# Altium schematic sheet rx.SchDoc
size Letter; CompanyName: Signal Laboratories, Inc.; Address1: 3479 Edison Way; Address2: Menlo Park CA 94025; Address3: +1 (877) 778-8435; Address4: siglabs.com; Revision: 1; SheetNumber: 1; SheetTotal: 1
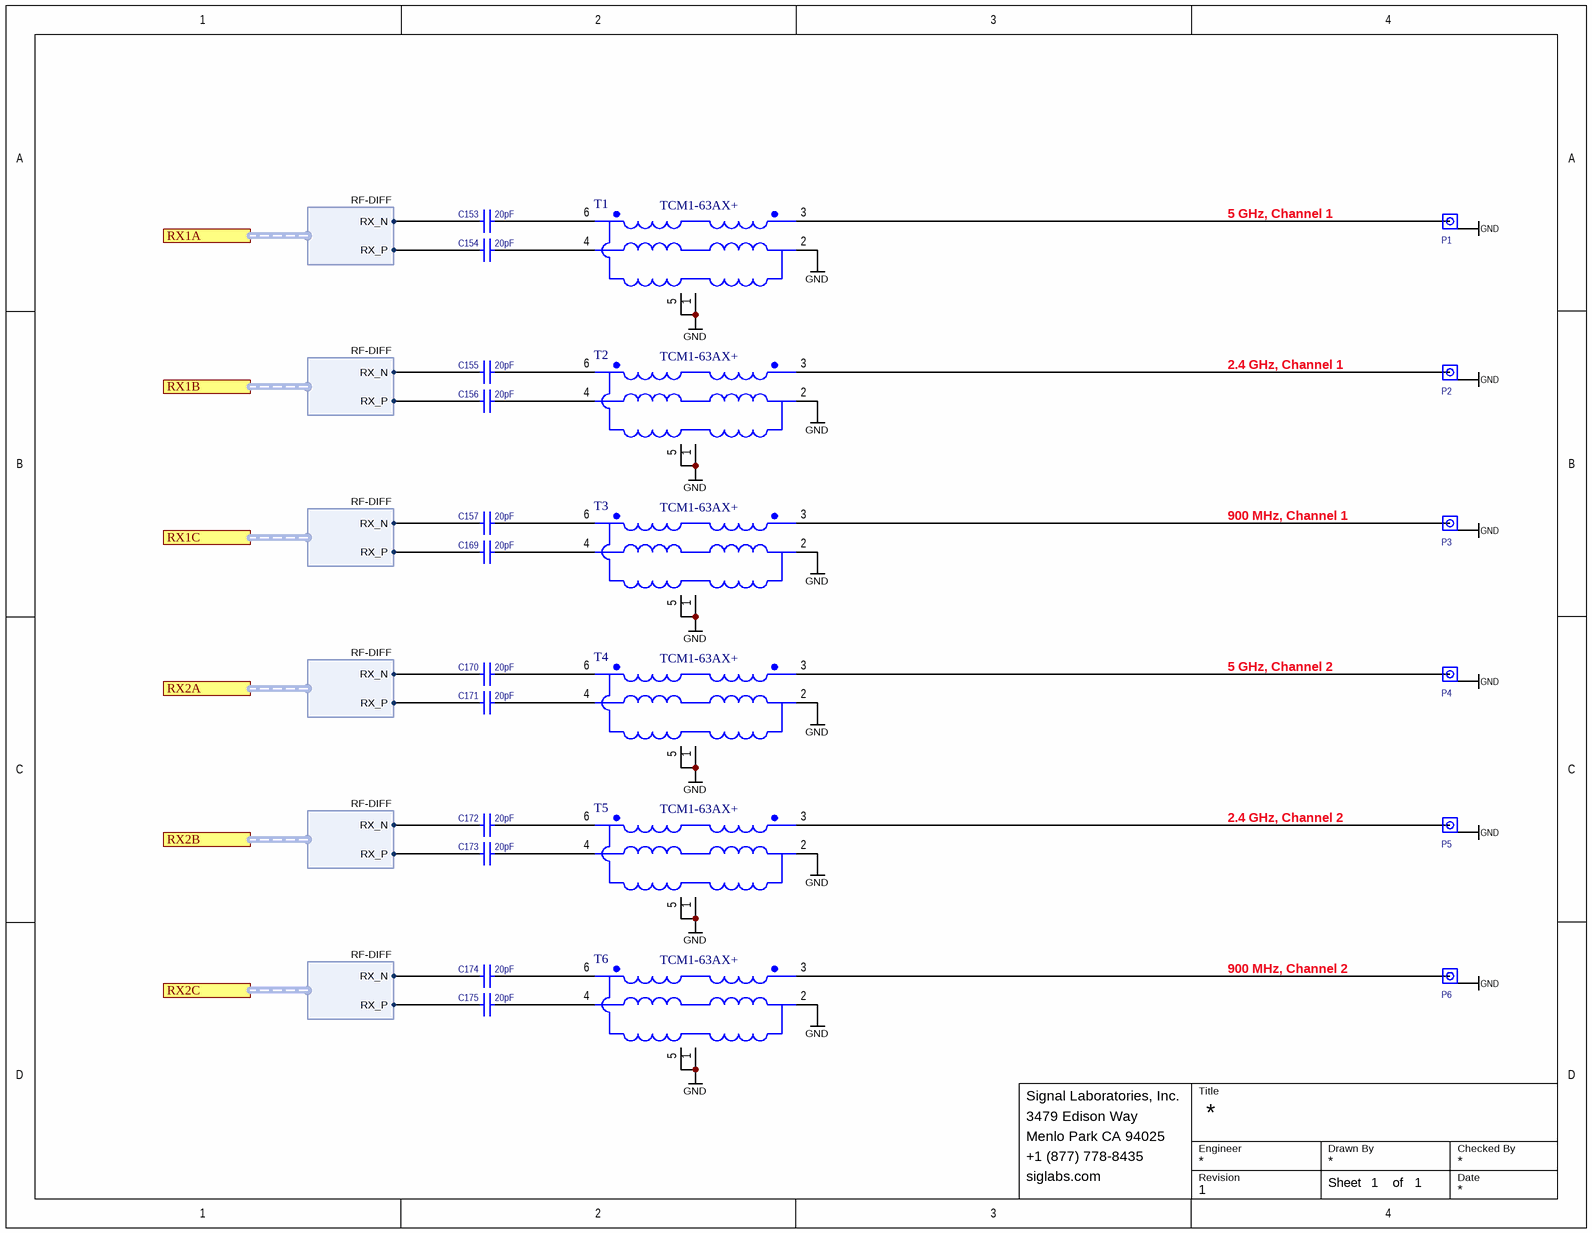
[diagram p0: rx.SchDoc]

## Parts
C153  value 20pF  [0402]  (hidden comment: CBR04C200F5GAC)
C154  value 20pF  [0402]  (hidden comment: CBR04C200F5GAC)
C155  value 20pF  [0402]  (hidden comment: CBR04C200F5GAC)
C156  value 20pF  [0402]  (hidden comment: CBR04C200F5GAC)
C157  value 20pF  [0402]  (hidden comment: CBR04C200F5GAC)
C169  value 20pF  [0402]  (hidden comment: CBR04C200F5GAC)
C170  value 20pF  [0402]  (hidden comment: CBR04C200F5GAC)
C171  value 20pF  [0402]  (hidden comment: CBR04C200F5GAC)
C172  value 20pF  [0402]  (hidden comment: CBR04C200F5GAC)
C173  value 20pF  [0402]  (hidden comment: CBR04C200F5GAC)
C174  value 20pF  [0402]  (hidden comment: CBR04C200F5GAC)
C175  value 20pF  [0402]  (hidden comment: CBR04C200F5GAC)
P1  U.FL-R-SMT(10)  [U.FL-R-SMT(10)]  (value not drawn)
P2  U.FL-R-SMT(10)  [U.FL-R-SMT(10)]  (value not drawn)
P3  U.FL-R-SMT(10)  [U.FL-R-SMT(10)]  (value not drawn)
P4  U.FL-R-SMT(10)  [U.FL-R-SMT(10)]  (value not drawn)
P5  U.FL-R-SMT(10)  [U.FL-R-SMT(10)]  (value not drawn)
P6  U.FL-R-SMT(10)  [U.FL-R-SMT(10)]  (value not drawn)
T1  TCM1-63AX+  [TCM1-63AX+]
T2  TCM1-63AX+  [TCM1-63AX+]
T3  TCM1-63AX+  [TCM1-63AX+]
T4  TCM1-63AX+  [TCM1-63AX+]
T5  TCM1-63AX+  [TCM1-63AX+]
T6  TCM1-63AX+  [TCM1-63AX+]

## Ports
RX1A (harness RF-DIFF), RX1B (harness RF-DIFF), RX1C (harness RF-DIFF), RX2A (harness RF-DIFF), RX2B (harness RF-DIFF), RX2C (harness RF-DIFF)

## Harnesses
RF-DIFF: RX_N, RX_P

## Nets
GND: P1.2(GND) P2.2(GND) P3.2(GND) P4.2(GND) P5.2(GND) P6.2(GND) T1.1 T1.2 T1.5 T2.1 T2.2 T2.5 T3.1 T3.2 T3.5 T4.1 T4.2 T4.5 T5.1 T5.2 T5.5 T6.1 T6.2 T6.5
NetC153_1: C153.1 ; port RX1A.RX_N
NetC153_2: C153.2 T1.6
NetC154_1: C154.1 ; port RX1A.RX_P
NetC154_2: C154.2 T1.4
NetC155_1: C155.1 ; port RX1B.RX_N
NetC155_2: C155.2 T2.6
NetC156_1: C156.1 ; port RX1B.RX_P
NetC156_2: C156.2 T2.4
NetC157_1: C157.1 ; port RX1C.RX_N
NetC157_2: C157.2 T3.6
NetC169_1: C169.1 ; port RX1C.RX_P
NetC169_2: C169.2 T3.4
NetC170_1: C170.1 ; port RX2A.RX_N
NetC170_2: C170.2 T4.6
NetC171_1: C171.1 ; port RX2A.RX_P
NetC171_2: C171.2 T4.4
NetC172_1: C172.1 ; port RX2B.RX_N
NetC172_2: C172.2 T5.6
NetC173_1: C173.1 ; port RX2B.RX_P
NetC173_2: C173.2 T5.4
NetC174_1: C174.1 ; port RX2C.RX_N
NetC174_2: C174.2 T6.6
NetC175_1: C175.1 ; port RX2C.RX_P
NetC175_2: C175.2 T6.4
NetP1_1: P1.1(RF) T1.3
NetP2_1: P2.1(RF) T2.3
NetP3_1: P3.1(RF) T3.3
NetP4_1: P4.1(RF) T4.3
NetP5_1: P5.1(RF) T5.3
NetP6_1: P6.1(RF) T6.3

## Notes on the sheet
- 5 GHz, Channel 1
- 2.4 GHz, Channel 1
- 900 MHz, Channel 1
- 5 GHz, Channel 2
- 2.4 GHz, Channel 2
- 900 MHz, Channel 2
- Title
- Engineer
- Revision
- Drawn By
- Checked By
- Date
- Sheet
- of

## Library data of the parts
C153-C157 C169-C175 = CAP 0402: Ceramic Capacitor 20pF ±1% 50V NP0 0402; Manufacturer: Kemet; Tr: -55:125; Voltage: 50V; Manufacturer P/N: CBR04C200F5GAC; Package: 0402; Tolerance: ±1%
P1-P6 = U.FL-R-SMT(10): Ultra Miniature Coaxial Jack, 50 Ohms; Manufacturer: Hirose; Manufacturer P/N: U.FL-R-SMT(10)
T1-T6 = TCM1-63AX+: RF Transformer 10-6000KHz; Manufacturer: Mini-Circuits; Manufacturer P/N: TC1-1-13M